# EAGLE schematic d11_micro_std_vcp_v2 (EAGLE 7.3.0)
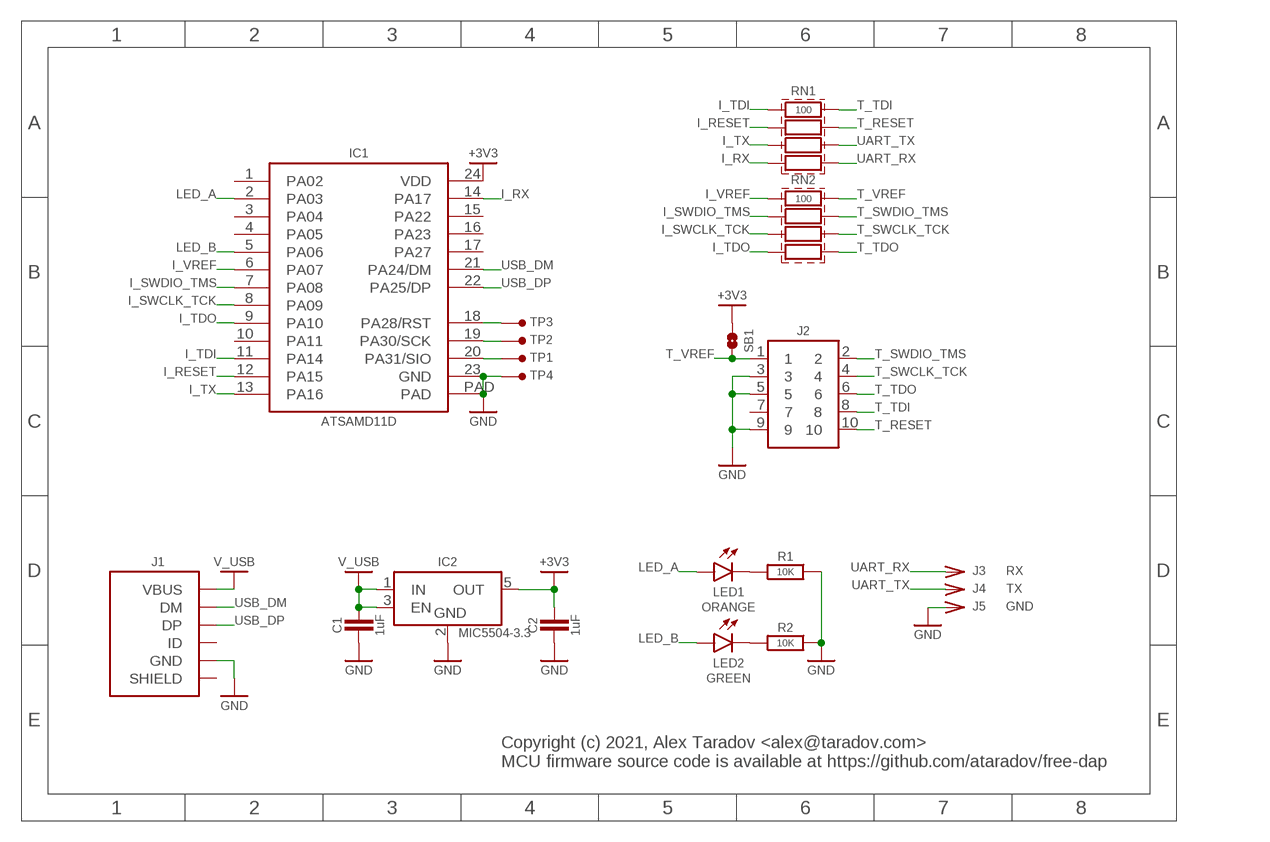
[diagram p0: schematic, sheet 1]

## Parts
C1  1uF  C-0603  [SMD0603]
C2  1uF  C-0603  [SMD0603]
IC1  ATSAMD11D  [QFN24]
IC2  MIC5504-3.3  MIC5504-SOT23-5  [SOT23-5]
J1  USB-B-MICRO-SMT  [USB-B-MICRO-SMT-SHELL-TH]
J2  HEADER-5X2-TH-1.27  [HEADER-5X2-1.27MM]
J3  RX  CONN-SINGLE-TH  [PIN-TH]
J4  TX  CONN-SINGLE-TH  [PIN-TH]
J5  GND  CONN-SINGLE-TH  [PIN-TH]
LED1  ORANGE  LED_SMDLED_0603  [SMD0603]
LED2  GREEN  LED_SMDLED_0603  [SMD0603]
R1  10K  R-0603  [SMD0603]
R2  10K  R-0603  [SMD0603]
RN1  100  RN-4-0603-X4  [SMD0603-X4]
RN2  100  RN-4-0603-X4  [SMD0603-X4]
SB1  SOLDER-BRIDGE-1.27MM-NO  [SB-1.27MM-NO]
TP1  SIO  TEST-POINT-1.27MM  [TP-1.27MM]
TP2  TEST-POINT-1.27MM  [TP-1.27MM]
TP3  TEST-POINT-1.27MM  [TP-1.27MM]
TP4  TEST-POINT-1.27MM  [TP-1.27MM]

## Nets
+3V3: C2.2 IC1.24(VDD) IC2.5(OUT) SB1.1
GND: C1.1 C2.1 IC1.23(GND) IC1.PAD IC2.2(GND) J1.5(GND) J2.3 J2.5 J2.9 J5.1 R1.2 R2.2 TP4.1
I_RESET: IC1.12(PA15) RN1.7
I_RX: IC1.14(PA17) RN1.5
I_SWCLK_TCK: IC1.8(PA09) RN2.6
I_SWDIO_TMS: IC1.7(PA08) RN2.7
I_TDI: IC1.11(PA14) RN1.8
I_TDO: IC1.9(PA10) RN2.5
I_TX: IC1.13(PA16) RN1.6
I_VREF: IC1.6(PA07) RN2.8
LED_A: IC1.2(PA03) LED1.1(A)
LED_B: IC1.5(PA06) LED2.1(A)
N$2: LED1.2(C) R1.1
N$3: LED2.2(C) R2.1
RESET: IC1.18(PA28/RST) TP3.1
SWCLK: IC1.19(PA30/SCK) TP2.1
SWDIO: IC1.20(PA31/SIO) TP1.1
T_RESET: J2.10 RN1.2
T_SWCLK_TCK: J2.4 RN2.3
T_SWDIO_TMS: J2.2 RN2.2
T_TDI: J2.8 RN1.1
T_TDO: J2.6 RN2.4
T_VREF: J2.1 RN2.1 SB1.2
UART_RX: J3.1 RN1.4
UART_TX: J4.1 RN1.3
USB_DM: IC1.21(PA24/DM) J1.2(DM)
USB_DP: IC1.22(PA25/DP) J1.3(DP)
V_USB: C1.2 IC2.1(IN) IC2.3(EN) J1.1(VBUS)
Unconnected: IC1.1(PA02) IC1.3(PA04) IC1.4(PA05) IC1.10(PA11) IC1.15(PA22) IC1.16(PA23) IC1.17(PA27) J1.4(ID) J1.M1(SHIELD) J1.M2(SHIELD) J1.M3(SHIELD) J1.M4(SHIELD) J2.7

## Notes on the sheet
- Copyright (c) 2021, Alex Taradov <alex@taradov.com>
  MCU firmware source code is available at https://github.com/ataradov/free-dap

## Library data of the parts
C1 C2 = ataradov_rlc:C
IC1 = ataradov_mcu:ATSAMD11D
IC2 = ataradov_vreg:MIC5504: LM1117 voltage regulator
J1 = ataradov_conn:USB-B-MICRO
J2 = ataradov_conn:HEADER-5X2
J3-J5 = ataradov_conn:CONN-SINGLE
LED1 LED2 = ataradov_led:LED_SMD: SMD_LED
R1 R2 = ataradov_rlc:R
RN1 RN2 = ataradov_rlc:RN-4
SB1 = ataradov_misc:SOLDER-BRIDGE: Solder Bridge
TP1-TP4 = ataradov_misc:TEST-POINT: Test Point